# Altium schematic sheet Top-Sheet.SchDoc
size Letter; Organization: Cegep Limoilou; Address1: 1300, 8e Avenue; Address2: Québec, QC; Address3: Canada; Address4: G1J 5L5; Revision: Enseignants; SheetNumber: 1; SheetTotal: 8; Conception: Ilyes Gharmoul; Titre: ADAM BACK-DOOR SYST; Modification: Ilyes G
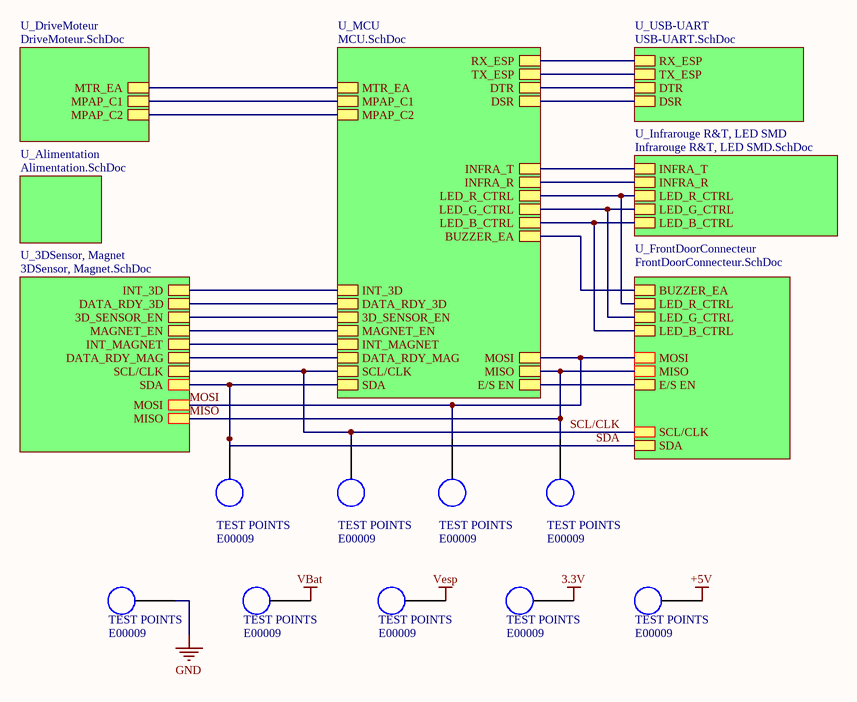
[diagram p0: Top-Sheet.SchDoc]

## Parts
T3  TEST POINTS  ADAM Inventory Number 1: E00009  [TEST POINTS]
T4  TEST POINTS  ADAM Inventory Number 1: E00009  [TEST POINTS]
T5  TEST POINTS  ADAM Inventory Number 1: E00009  [TEST POINTS]
T6  TEST POINTS  ADAM Inventory Number 1: E00009  [TEST POINTS]
T7  TEST POINTS  ADAM Inventory Number 1: E00009  [TEST POINTS]
T8  TEST POINTS  ADAM Inventory Number 1: E00009  [TEST POINTS]
T9  TEST POINTS  ADAM Inventory Number 1: E00009  [TEST POINTS]
T10  TEST POINTS  ADAM Inventory Number 1: E00009  [TEST POINTS]
T11  TEST POINTS  ADAM Inventory Number 1: E00009  [TEST POINTS]

## Sub-sheets
U_3DSensor, Magnet = 3DSensor, Magnet.SchDoc: MOSI, MISO, SDA, SCL/CLK, 3D_SENSOR_EN, MAGNET_EN, INT_MAGNET, DATA_RDY_MAG, INT_3D, DATA_RDY_3D
U_Alimentation = Alimentation.SchDoc: no entries
U_DriveMoteur = DriveMoteur.SchDoc: MPAP_C1, MPAP_C2, MTR_EA
U_FrontDoorConnecteur = FrontDoorConnecteur.SchDoc: BUZZER_EA, LED_R_CTRL, LED_G_CTRL, LED_B_CTRL, MOSI, MISO, E/S EN, SCL/CLK, SDA
U_Infrarouge R&T, LED SMD = Infrarouge R&T, LED SMD.SchDoc: INFRA_T, INFRA_R, LED_R_CTRL, LED_G_CTRL, LED_B_CTRL
U_MCU = MCU.SchDoc: LED_R_CTRL, LED_G_CTRL, LED_B_CTRL, MPAP_C1, MPAP_C2, MOSI, MISO, INFRA_R, MTR_EA, BUZZER_EA, SDA, INFRA_T, RX_ESP, TX_ESP, DTR, DSR, SCL/CLK, 3D_SENSOR_EN, MAGNET_EN, INT_MAGNET, DATA_RDY_MAG, INT_3D, DATA_RDY_3D, E/S EN
U_USB-UART = USB-UART.SchDoc: RX_ESP, TX_ESP, DSR, DTR

## Nets
3.3V: T10.1
+5V: T11.1
GND: T7.1
VBat: T8.1
Vesp: T9.1
MISO: T6.1 ; sheet U_MCU/MISO, sheet U_3DSensor, Magnet/MISO, sheet U_FrontDoorConnecteur/MISO
MOSI: T5.1 ; sheet U_MCU/MOSI, sheet U_3DSensor, Magnet/MOSI, sheet U_FrontDoorConnecteur/MOSI
SCL/CLK: T4.1 ; sheet U_MCU/SCL/CLK, sheet U_3DSensor, Magnet/SCL/CLK, sheet U_FrontDoorConnecteur/SCL/CLK
SDA: T3.1 ; sheet U_MCU/SDA, sheet U_3DSensor, Magnet/SDA, sheet U_FrontDoorConnecteur/SDA
(unnamed): sheet U_DriveMoteur/MPAP_C1, sheet U_MCU/MPAP_C1
(unnamed): sheet U_DriveMoteur/MPAP_C2, sheet U_MCU/MPAP_C2
(unnamed): sheet U_DriveMoteur/MTR_EA, sheet U_MCU/MTR_EA
(unnamed): sheet U_MCU/LED_R_CTRL, sheet U_FrontDoorConnecteur/LED_R_CTRL, sheet U_Infrarouge R&T, LED SMD/LED_R_CTRL
(unnamed): sheet U_MCU/LED_G_CTRL, sheet U_FrontDoorConnecteur/LED_G_CTRL, sheet U_Infrarouge R&T, LED SMD/LED_G_CTRL
(unnamed): sheet U_MCU/LED_B_CTRL, sheet U_FrontDoorConnecteur/LED_B_CTRL, sheet U_Infrarouge R&T, LED SMD/LED_B_CTRL
(unnamed): sheet U_MCU/INFRA_R, sheet U_Infrarouge R&T, LED SMD/INFRA_R
(unnamed): sheet U_MCU/BUZZER_EA, sheet U_FrontDoorConnecteur/BUZZER_EA
(unnamed): sheet U_MCU/INFRA_T, sheet U_Infrarouge R&T, LED SMD/INFRA_T
(unnamed): sheet U_MCU/RX_ESP, sheet U_USB-UART/RX_ESP
(unnamed): sheet U_MCU/TX_ESP, sheet U_USB-UART/TX_ESP
(unnamed): sheet U_MCU/DTR, sheet U_USB-UART/DTR
(unnamed): sheet U_MCU/DSR, sheet U_USB-UART/DSR
(unnamed): sheet U_MCU/3D_SENSOR_EN, sheet U_3DSensor, Magnet/3D_SENSOR_EN
(unnamed): sheet U_MCU/MAGNET_EN, sheet U_3DSensor, Magnet/MAGNET_EN
(unnamed): sheet U_MCU/INT_MAGNET, sheet U_3DSensor, Magnet/INT_MAGNET
(unnamed): sheet U_MCU/DATA_RDY_MAG, sheet U_3DSensor, Magnet/DATA_RDY_MAG
(unnamed): sheet U_MCU/INT_3D, sheet U_3DSensor, Magnet/INT_3D
(unnamed): sheet U_MCU/DATA_RDY_3D, sheet U_3DSensor, Magnet/DATA_RDY_3D
(unnamed): sheet U_MCU/E/S EN, sheet U_FrontDoorConnecteur/E/S EN

## Notes on the sheet
- Titre :
- Conception :
- Date :
- Modification :
- Heure :
- Révision :
- Feuille
- de
- Fichier :

## Library data of the parts
T3-T11 = TEST POINTS: RCWCTE TEST POINTS; Manufacturer Part Number 1: RCWCTE